# EAGLE schematic 1uprava5 (EAGLE 9.5.2)
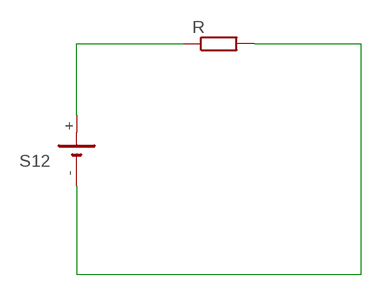
[diagram p0: schematic, sheet 1]

## Parts
R  680R  R-EU_0204/7  [0204/7]
S12  135V  CH291-1220LF  [CH291-1220LF]

## Nets
N$1: R.1 S12.+
N$2: R.2 S12.-

## Library data of the parts
R = rcl:R-EU_: RESISTOR, European symbol; SPICEPREFIX: R
S12 = battery:CH291-1220LF: Battery Holder, SMT, 12mm multicomp PART NO. CH291-1220LF Source: Data sheet <http://www.farnell.com/datasheets/1505860.pdf>